# EasyEDA Pro project self-balancing-robot.eprj

# Schematic Schematic1
Board Name: Board1; Create Date: 2025-12-27; Page Name: P1; Project Name: self-balancing-robot; Schematic Name: Schematic1; Update Date: 2025-12-27; Company: EasyEDA.com; Page Size: A4; Version: V1.0
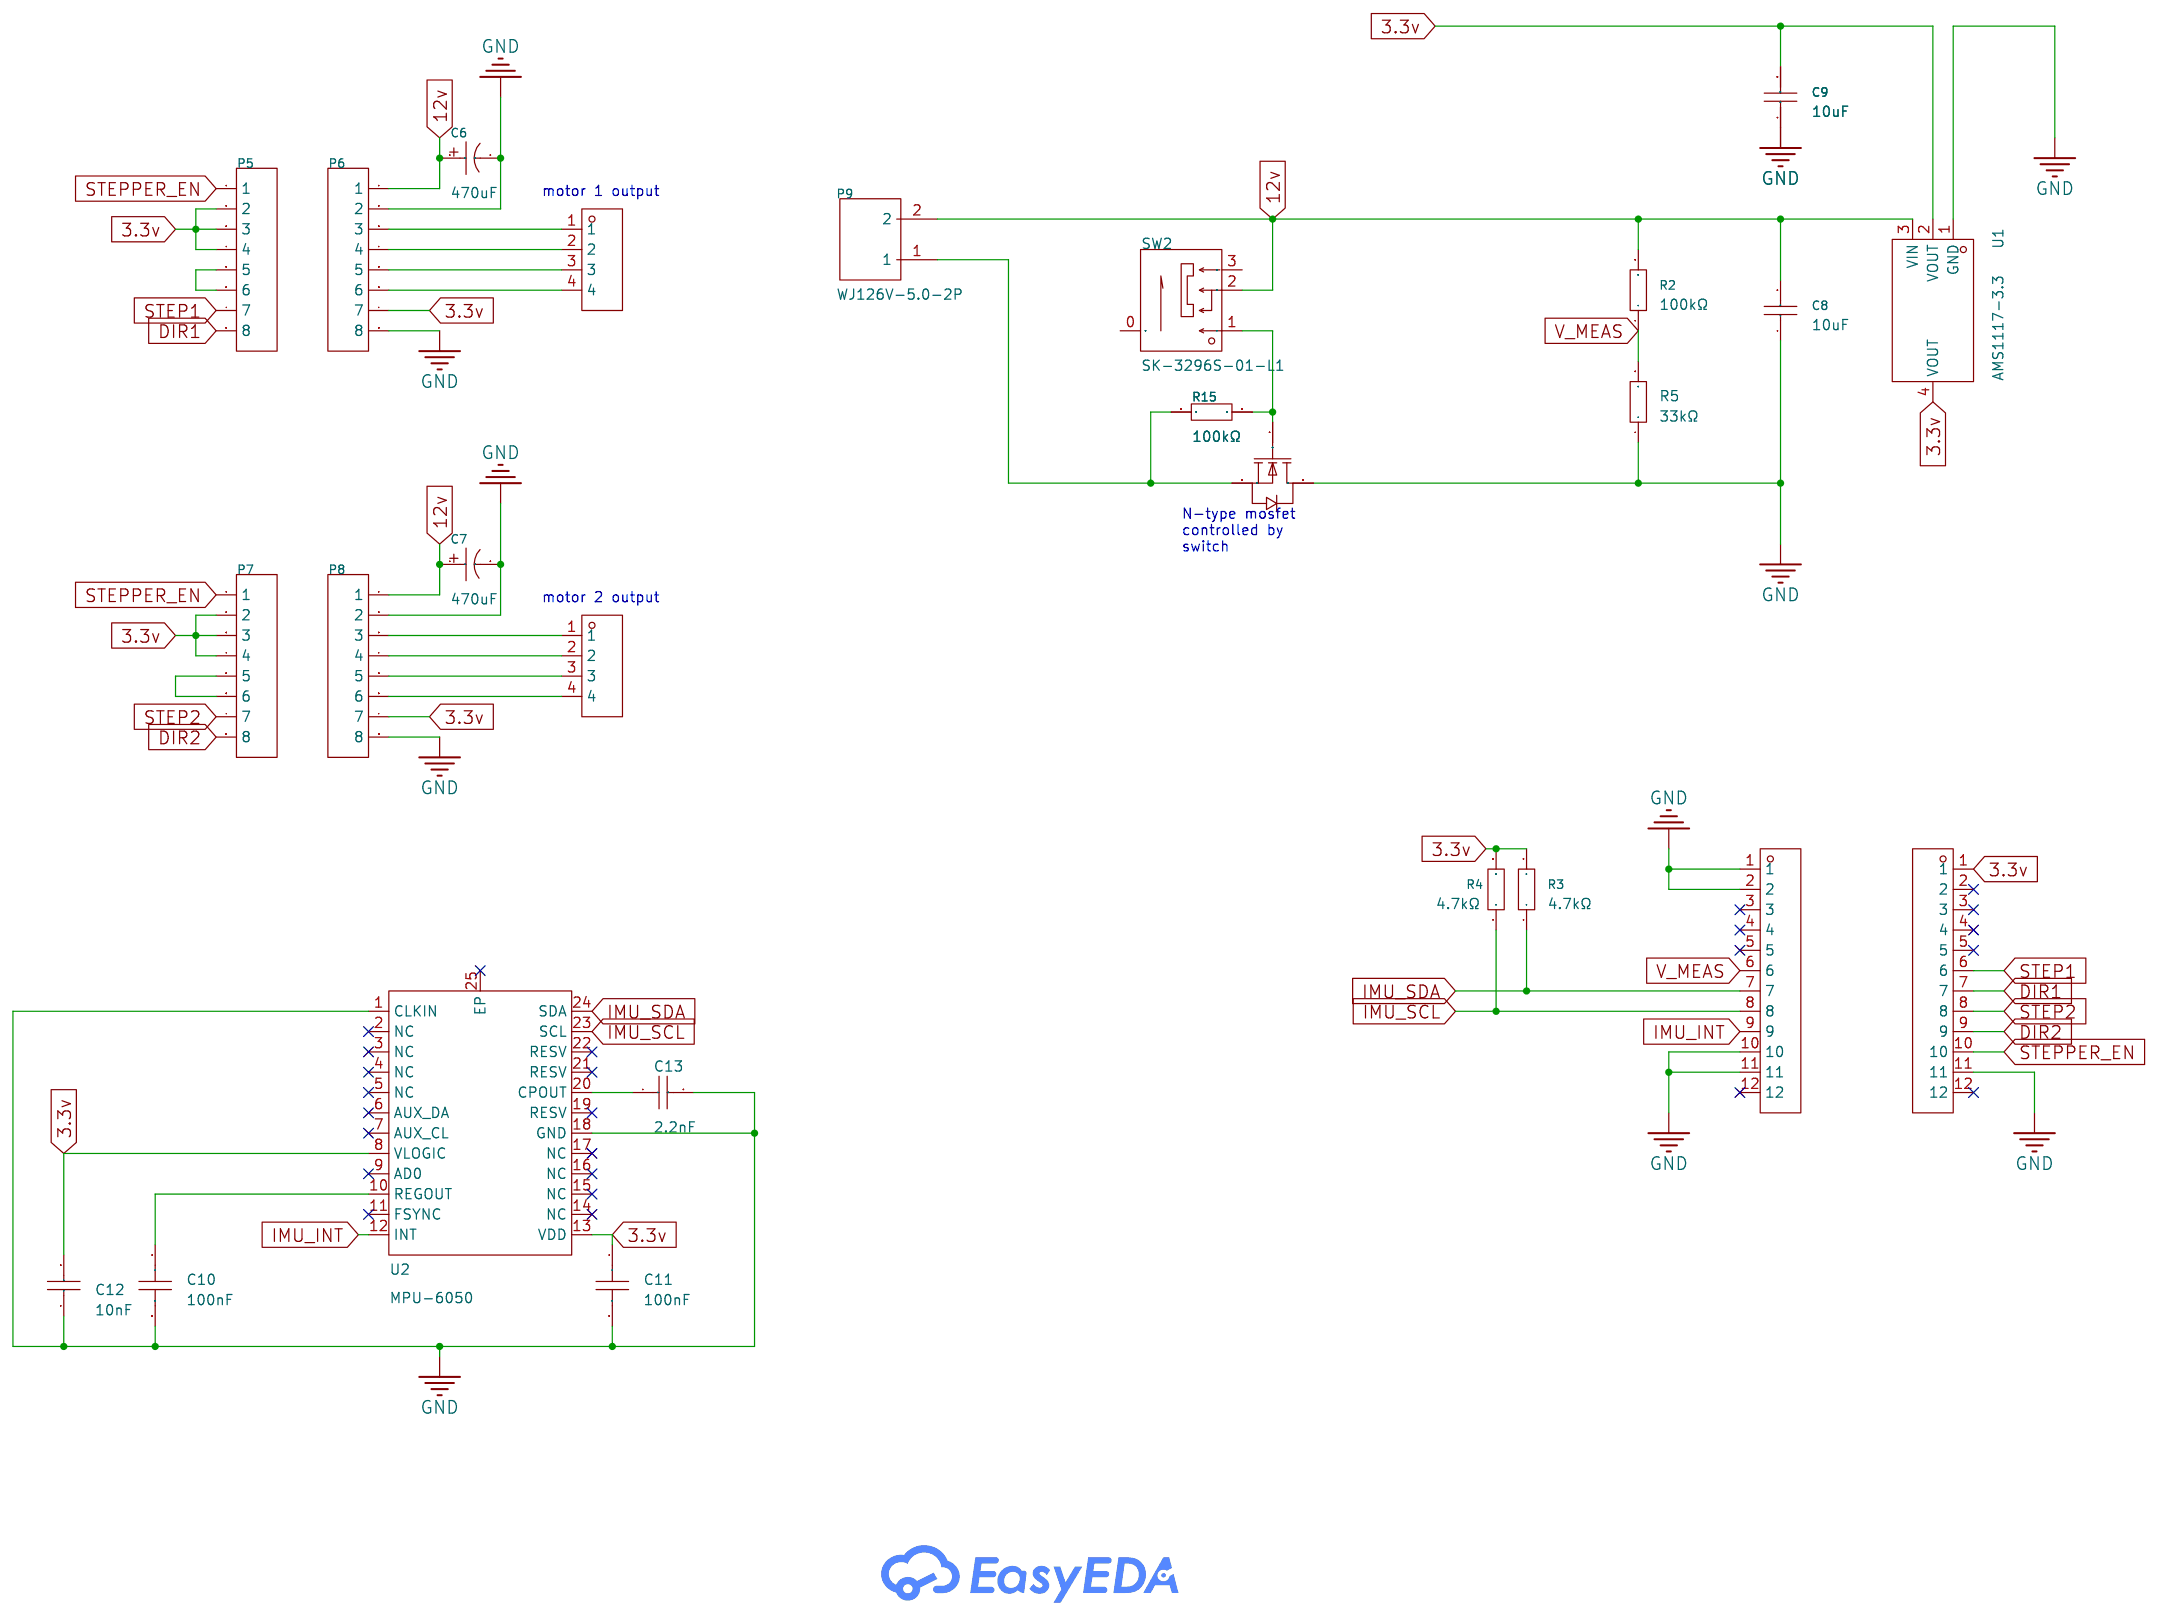
[diagram p0: schematic sheet]

## Parts
C6  470uF  [CAP-TH_BD8.0-P3.50-D0.6-FD]  (no BOM)
C7  470uF  [CAP-TH_BD8.0-P3.50-D0.6-FD]  (no BOM)
C8  10uF  [C1206]
C9  10uF  [C1206]
C10  100nF  [C0402]
C11  100nF  [C0402]
C12  10nF  [C0402]
C13  2.2nF  [C0402]
H1  PM2.54-1*12  [HDR-TH_12P-P2.54-V-F]  (no BOM)
H2  PM2.54-1*12  [HDR-TH_12P-P2.54-V-F]  (no BOM)
H5  2.54-1*4P母  [HDR-TH_4P-P2.54-V-F]  (no BOM)
H6  2.54-1*4P母  [HDR-TH_4P-P2.54-V-F]  (no BOM)
P5  2.54-1*8P母环保  [HDR-TH_8P-P2.54-V-F-1]  (no BOM)
P6  2.54-1*8P母环保  [HDR-TH_8P-P2.54-V-F-1]  (no BOM)
P7  2.54-1*8P母环保  [HDR-TH_8P-P2.54-V-F-1]  (no BOM)
P8  2.54-1*8P母环保  [HDR-TH_8P-P2.54-V-F-1]  (no BOM)
P9  WJ126V-5.0-2P  [CONN-TH_WJ126V-5.0-2P]  (no BOM)
Q1  AO3400A  [SOT-23-3_L2.9-W1.6-P1.90-LS2.8-BR]
R2  100kΩ  [R0402]
R3  4.7kΩ  [R0402]
R4  4.7kΩ  [R0402]
R5  33kΩ  [R0402]
R15  100kΩ  [R0402]
SW2  SK-3296S-01-L1  [SW-SMD_3P-P1.50_L2.7-W6.6]
U1  AMS1117-3.3  [SOT-223-3_L6.5-W3.4-P2.30-LS7.0-BR]
U2  MPU-6050  [QFN-24_L4.0-W4.0-P0.50-BL-EP2.7]

## Library data of the parts
C6 C7 = KM477M016F12RR0VH2FP0: Capacitance:470uF Tolerance:±20% Tolerance:±20% Rated Voltage: Lead Spacing: φD: L: Lifetime @ Temp:2000hrs@105℃; LCSC Part Name: 470uF ±20% 16V; Supplier Part: C28067; Manufacturer: CX(承兴); Supplier Footprint: 插件,D8xL12mm; JLCPCB Part Class: Extended Part; Datasheet: https://atta.szlcsc.com/upload/public/pdf/source/20211027/06D6BA3719C264B639DC286D935D03EA.pdf; Supplier: LCSC; Tolerance: ±20%; Lifetime @ Temp: 2000hrs@105℃
C8 C9 = CL31A106KBHNNNE: Capacitance: Tolerance:±10% Tolerance:±10% Voltage Rated: Temperature Coefficient:; LCSC Part Name: 10uF ±10% 50V; Supplier Part: C13585; Manufacturer: SAMSUNG(三星); Supplier Footprint: 1206; JLCPCB Part Class: Basic Part; Datasheet: https://atta.szlcsc.com/upload/public/pdf/source/20160218/1457707763339.pdf; Supplier: LCSC; Tolerance: ±10%
C10 C11 = CL05B104KO5NNNC: LCSC Part Name: 100nF ±10% 16V; Supplier Part: C1525; Manufacturer: SAMSUNG(三星); Supplier Footprint: 0402; JLCPCB Part Class: Basic Part; Datasheet: https://item.szlcsc.com/datasheet/CL05B104KO5NNNC/1877.html; Supplier: LCSC; Tolerance: ±10%; Voltage Rating: 16V; Temperature Coefficient: X7R
C12 = CL05B103KB5NNNC: LCSC Part Name: 10nF ±10% 50V; Supplier Part: C15195; Manufacturer: SAMSUNG(三星); Supplier Footprint: 0402; JLCPCB Part Class: Basic Part; Datasheet: https://item.szlcsc.com/datasheet/CL05B103KB5NNNC/15869.html; Supplier: LCSC; Tolerance: ±10%; Voltage Rating: 50V; Temperature Coefficient: X7R
C13 = 0402B222K500NT: LCSC Part Name: 2.2nF ±10% 50V; Supplier Part: C1531; Manufacturer: FH(风华); Supplier Footprint: 0402; JLCPCB Part Class: Extended Part; Datasheet: https://item.szlcsc.com/datasheet/0402B222K500NT/1883.html; Supplier: LCSC; Tolerance: ±10%; Voltage Rating: 50V; Temperature Coefficient: X7R
H1 H2 = PM2.54-1*12: Holes Structure:1x12P Pitch:2.54mm Row Spacing:2.54mm Circular Hole / Square Hole:方孔 Mounting Type:Straight Number of Rows:Plugin Number of Holes:12P Current Rating (Max):2.5A Holes Direction:Top Insulation Height:8.5mm Operating Temperature Range:-40℃~+1; LCSC Part Name: 间距:2.54mm 1x12P 直插; Supplier Part: C5224029; Manufacturer: ZHOURI(洲日); Supplier Footprint: 插件,P=2.54mm; JLCPCB Part Class: Extended Part; Datasheet: https://atta.szlcsc.com/upload/public/pdf/source/20221031/8E1EDE7098C69E0E34EB4CABE01AB99F.pdf; Supplier: LCSC; Holes Structure: 1x12P; Pitch: 2.54mm; Row Spacing: 2.54mm; Circular Hole / Square Hole: 方孔; Mounting Type: Straight; Number of Rows: Plugin; Number of Holes: 12P; Current Rating (Max): 2.5A; Holes Direction: Top; Insulation Height: 8.5mm; Operating Temperature Range: -40℃~+105℃
H5 H6 = 2.54-1*4P母: Holes Structure:1x4P Pitch:2.54mm Row Spacing:- Circular Hole / Square Hole:Square Holes Mounting Type:Straight Number of Rows:Plugin Number of Holes:4P Current Rating (Max):3A Voltage Rating (Max):- Holes Direction:Top Insulation Height:- Contact Materia; LCSC Part Name: 间距:2.54mm 1x4P 直插; Supplier Part: C2718488; Manufacturer: BOOMELE(博穆精密); Supplier Footprint: 插件,P=2.54mm; JLCPCB Part Class: Extended Part; Datasheet: https://atta.szlcsc.com/upload/public/pdf/source/20210301/C2718488_F4427B881E42CAA8DDB0B1C12B3A522C.pdf; Supplier: LCSC; Holes Structure: 1x4P; Pitch: 2.54mm; Circular Hole / Square Hole: Square Holes; Mounting Type: Straight; Number of Rows: Plugin; Number of Holes: 4P; Current Rating (Max): 3A; Holes Direction: Top; Contact Material: bronze; Operating Temperature Range: -40℃~+105℃
P5-P8 = 2.54-1*8P母环保: Holes Structure:1x8P Pitch:2.54mm Row Spacing:- Mounting Type:Straight Number of Rows:Plugin Number of Holes:8P Insulation Height:- Contact Material:- Contact Plating:-; LCSC Part Name: 间距:2.54mm 1x8P 直插; Supplier Part: C27438; Manufacturer: BOOMELE(博穆精密); Supplier Footprint: 插件,P=2.54mm; JLCPCB Part Class: Extended Part; Datasheet: https://atta.szlcsc.com/upload/public/pdf/source/20231221/1CA800C6799ED97958773716FAA1BFFE.pdf; Supplier: LCSC; Holes Structure: 1x8P; Pitch: 2.54mm; Mounting Type: Straight; Number of Rows: Plugin; Number of Holes: 8P
P9 = WJ126V-5.0-2P: Structure:1x2P Pitch:5mm Color:Green Mounting Style:Straight Current Rating (Max):18A Voltage Rating (Max):250V Number of Pins:2P Number of Rows:1 Wire Gauge - AWG:14~26 Wire Gauge - AWG:14~26 Wire Gauge - mm2:2.5 Wire Gauge - mm2:2.5 Number of PINs Per R; LCSC Part Name: 5mm 1x2P 排数:1 每排P数:2 直插; Supplier Part: C8404; Manufacturer: KANGNEX(康奈克斯电气); Supplier Footprint: 插件,P=5mm; JLCPCB Part Class: Extended Part; Datasheet: https://atta.szlcsc.com/upload/public/pdf/source/20191225/C8404_8F52D87DF851D149A4DEA9BD9FA83F9A.pdf; Supplier: LCSC; Structure: 1x2P; Pitch: 5mm; Color: Green; Mounting Style: Straight; Current Rating (Max): 18A; Voltage Rating (Max): 250V; Number of Pins: 2P; Number of Rows: 1; Wire Gauge - AWG: 14~26; Wire Gauge - mm2: 2.5; Number of PINs Per Row: 2; Operating Temperature Range: -40℃~+105℃
Q1 = AO3400A_C20917: Type:1个NChannel Drain Source Voltage (Vdss): Continuous Drain Current (Id): Power Dissipation (Pd): Drain Source On Resistance (RDS(on)@Vgs,Id):26.5mΩ@10V,5.7A Gate Threshold Voltage (Vgs(th)@Id):1.5V@250uA Total Gate Charge (Qg@Vgs):7nC@4.5V Input Capaci; LCSC Part Name: 1个N沟道 耐压:30V 电流:5.7A; Supplier Part: C20917; Manufacturer: AOS; Supplier Footprint: SOT-23-3L; JLCPCB Part Class: Basic Part; Datasheet: https://atta.szlcsc.com/upload/public/pdf/source/20140107/1457706668533.pdf; Supplier: LCSC; Type: 1个NChannel; Drain Source On Resistance (RDS(on)@Vgs,Id): 26.5mΩ@10V,5.7A; Gate Threshold Voltage (Vgs(th)@Id): 1.5V@250uA; Total Gate Charge (Qg@Vgs): 7nC@4.5V; Input Capacitance (Ciss@Vds): 630pF@15V; Operating Temperature: -55℃~+150℃@(Tj)
R2 = 0402WGF1003TCE: LCSC Part Name: 100kΩ ±1% 62.5mW 厚膜电阻; Supplier Part: C25741; Manufacturer: UNI-ROYAL(厚声); Supplier Footprint: 0402; JLCPCB Part Class: Basic Part; Datasheet: https://item.szlcsc.com/datasheet/0402WGF1003TCE/26484.html; Supplier: LCSC; Type: Thick Film Resistor; Tolerance: ±1%; Power(Watts): 62.5mW; Voltage-Supply(Max): 50V; Temperature Coefficient: ±100ppm/℃; Operating Temperature: -55℃~+155℃
R3 R4 = 0402WGF4701TCE: LCSC Part Name: 4.7kΩ ±1% 62.5mW 厚膜电阻; Supplier Part: C25900; Manufacturer: UNI-ROYAL(厚声); Supplier Footprint: 0402; JLCPCB Part Class: Basic Part; Datasheet: https://item.szlcsc.com/datasheet/0402WGF4701TCE/26643.html; Supplier: LCSC; Type: Thick Film Resistor; Tolerance: ±1%; Power(Watts): 62.5mW; Voltage-Supply(Max): 50V; Temperature Coefficient: ±100ppm/℃; Operating Temperature: -55℃~+155℃
R5 = 0402WGF3302TCE: LCSC Part Name: 33kΩ ±1% 62.5mW 厚膜电阻; Supplier Part: C25779; Manufacturer: UNI-ROYAL(厚声); Supplier Footprint: 0402; JLCPCB Part Class: Basic Part; Datasheet: https://atta.szlcsc.com/upload/public/pdf/source/20200306/C422600_1E6D84923E4A46A82E41ADD87F860B5C.pdf; Supplier: LCSC; Type: Thick Film Resistors; Tolerance: ±1%; Temperature Coefficient: ±100ppm/℃; Operating Temperature Range: -55℃~+155℃
R15 = 0402WGF1003TCE: LCSC Part Name: 100kΩ ±1% 62.5mW 厚膜电阻; Supplier Part: C25741; Manufacturer: UNI-ROYAL(厚声); Supplier Footprint: 0402; JLCPCB Part Class: Basic Part; Datasheet: https://item.szlcsc.com/datasheet/0402WGF1003TCE/26484.html; Supplier: LCSC; Type: Thick Film Resistor; Tolerance: ±1%; Power(Watts): 62.5mW; Voltage-Supply(Max): 50V; Temperature Coefficient: ±100ppm/℃; Operating Temperature: -55℃~+155℃; Operating Temperature Range: -55℃~+155℃
SW2 = SK-3296S-01-L1: Circuit:SPDT Actuator Style:Rectangular columnar Pin Style:SMDSplicing Switch Length:7.8mm Switch Width:2.75mm Switch Height:1.35mm Mounting Style:卧贴 Actuator Color:Black Current Rating (DC):50mA Voltage Rating (DC):12V Current Rating (AC):50mA Voltage Ra; LCSC Part Name: 柄长1.5mm 卧贴双档 滑动开关; Supplier Part: C319020; Manufacturer: XKB Connectivity(中国星坤); Supplier Footprint: SMD; JLCPCB Part Class: Extended Part; Datasheet: https://atta.szlcsc.com/upload/public/pdf/source/20211011/33977E7F5E3AE40A3E3DC6795807E20F.pdf; Supplier: LCSC; Circuit: SPDT; Actuator Style: Rectangular columnar; Pin Style: SMDSplicing; Switch Length: 7.8mm; Switch Width: 2.75mm; Switch Height: 1.35mm; Mounting Style: 卧贴; Actuator Color: Black; Current Rating (DC): 50mA; Voltage Rating (DC): 12V; Current Rating (AC): 50mA; Voltage Rating (AC): 12V; Mechanical Life: 1万次; Operating Temperature: -40℃~+85℃
U1 = AMS1117-3.3_C6186: Output Type: Maximum Input Voltage:- Output Voltage:3.3V Output Voltage:3.3V MAX Output Current:1A Power Supply Rejection Ratio (PSRR):72dB@(120Hz) Dropout Voltage:1.3V@(800mA) standby current:- Noise:- Feature:- Operating Temperature:- Operating Temperat; LCSC Part Name: 输出3.3V 1A; Supplier Part: C6186; Manufacturer: AMS; Supplier Footprint: SOT-223; JLCPCB Part Class: Basic Part; Datasheet: https://atta.szlcsc.com/upload/public/pdf/source/20180727/C6186_7A095716F0823C02F1997A905E26C086.pdf; Supplier: LCSC; Output Voltage: 3.3V; MAX Output Current: 1A; Power Supply Rejection Ratio (PSRR): 72dB@(120Hz); Dropout Voltage: 1.3V@(800mA); Output Polarity: Positive electrode; Number of Outputs: 1
U2 = MPU-6050: Supplier Part: C24112; Manufacturer: TDK InvenSense(应美盛); Supplier Footprint: QFN-24-EP(4x4); JLCPCB Part Class: Extended Part; Datasheet: https://item.szlcsc.com/datasheet/MPU-6050/24852.html; Supplier: LCSC; Sensor Type: Accelerometer Gyroscope; Operating Temperature: -40℃~+85℃

## Nets
3.3v: C9.2 C11.1 C12.2 H2.1 P5.2 P5.3 P5.4 P6.7 P7.2 P7.3 P7.4 P8.7 R3.2 R4.2 U1.2(VOUT) U1.4(VOUT) U2.8(VLOGIC) U2.13(VDD)
12v: C6.1 C7.1 C8.2 P6.1 P8.1 P9.2 R2.2 SW2.2 U1.3(VIN)
GND: C6.2 C7.2 C8.1 C9.1 C10.2 C11.2 C12.1 C13.2 H1.1 H1.2 H1.10 H1.11 H2.11 P6.2 P6.8 P8.2 P8.8 Q1.3(D) R5.1 U1.1(GND) U2.1(CLKIN) U2.18(GND)
DIR1: H2.7 P5.8
DIR2: H2.9 P7.8
IMU_INT: H1.9 U2.12(INT)
IMU_SCL: H1.8 R4.1 U2.23(SCL)
IMU_SDA: H1.7 R3.1 U2.24(SDA)
STEP1: H2.6 P5.7
STEP2: H2.8 P7.7
STEPPER_EN: H2.10 P5.1 P7.1
V_MEAS: H1.6 R2.1 R5.2
$1N623: P5.5 P5.6
$1N627: H5.1 P6.3
$1N628: H5.2 P6.4
$1N629: H5.3 P6.5
$1N630: H5.4 P6.6
$1N913: P7.5 P7.6
$1N917: H6.1 P8.3
$1N918: H6.2 P8.4
$1N919: H6.3 P8.5
$1N920: H6.4 P8.6
$1N2427: C10.1 U2.10(REGOUT)
$1N2780: C13.1 U2.20(CPOUT)
$1N3371: P9.1 Q1.2(S) R15.2
$1N4399: Q1.1(G) R15.1 SW2.1

Not connected (* = marked no-connect by the designer): H1 3* 4* 5* 12*; H2 2* 3* 4* 5* 12*; SW2 0 3; U2 2(NC)* 3(NC)* 4(NC)* 5(NC)* 6(AUX_DA)* 7(AUX_CL)* 9(AD0)* 11(FSYNC)* 14(NC)* 15(NC)* 16(NC)* 17(NC)* 19(RESV)* 21(RESV)* 22(RESV)* 25(EP)*

## Notes on the sheet
- motor 1 output
- N-type mosfet
  controlled by
  switch
- motor 2 output

# Board PCB1
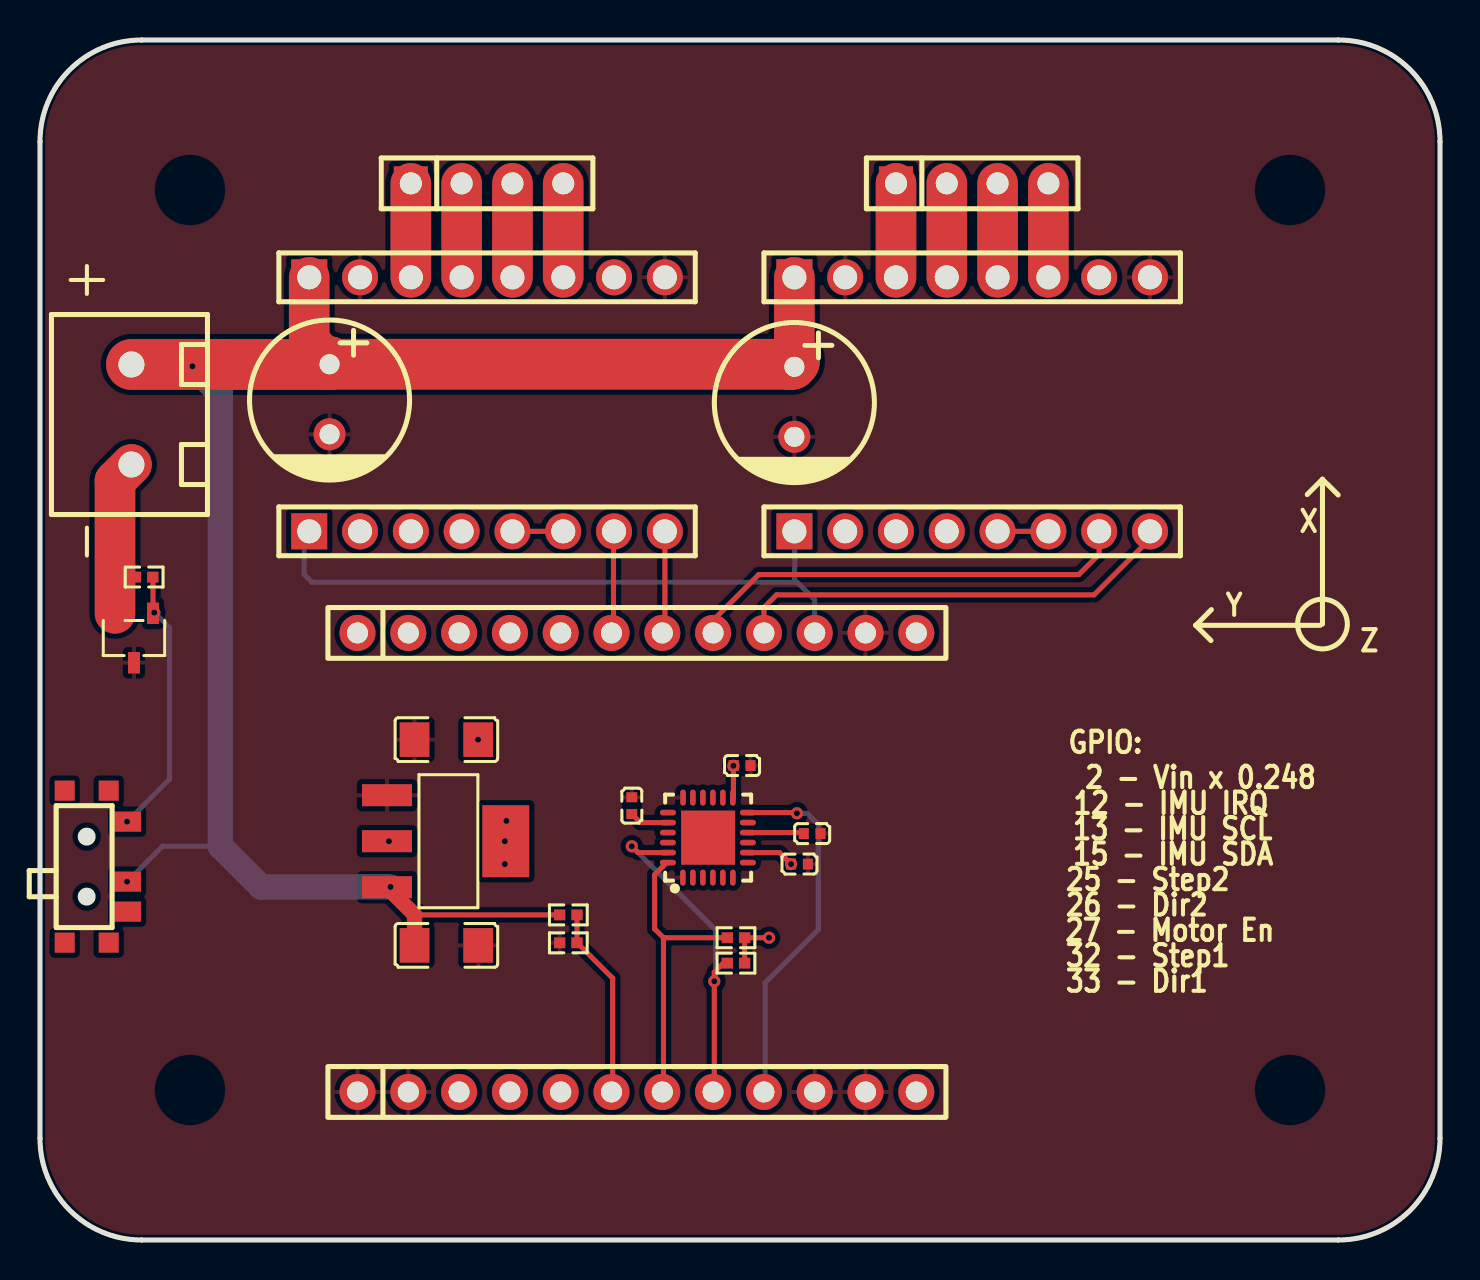
[diagram p1: board, top side]
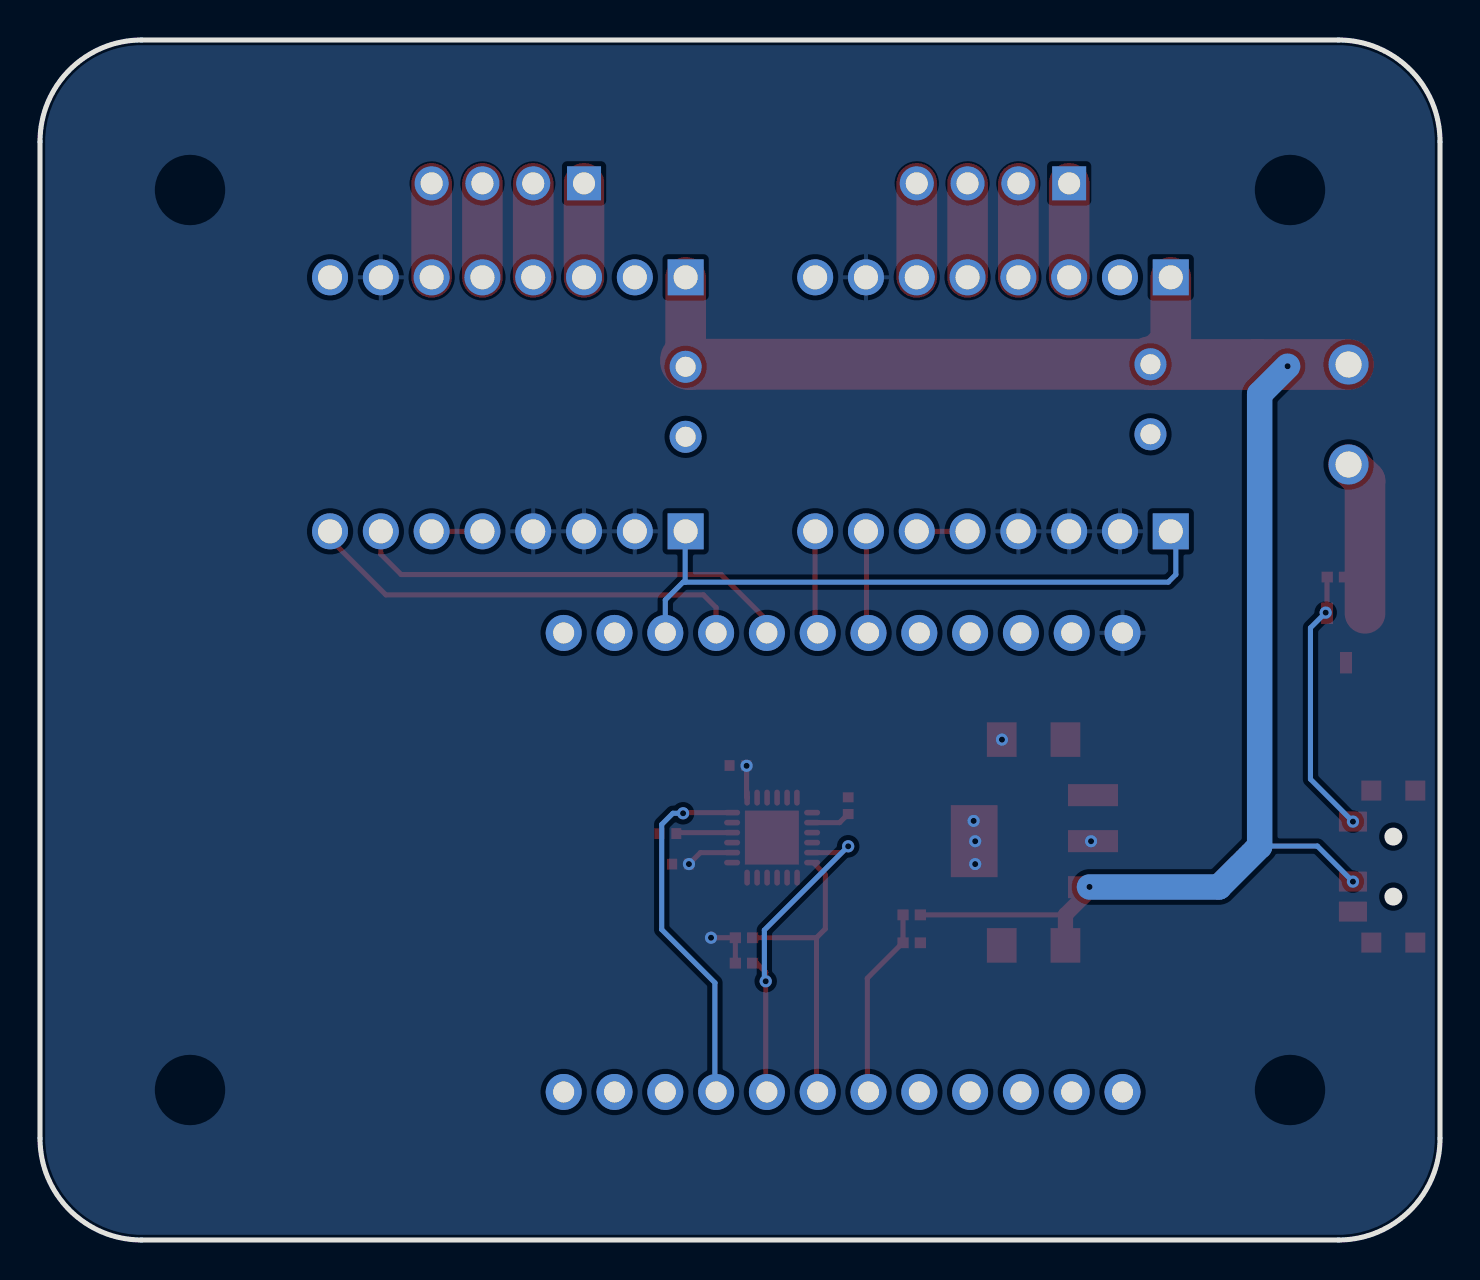
[diagram p2: board, bottom side, seen from below]

Outline 70 x 60 mm; copper layers: Top Layer, Bottom Layer. Coordinates in mm from the lower left corner of the outline.
Outline path: 0,54.92 0,5.08 arc(1.49,1.49) 5.08,0 64.92,0 arc(68.51,1.49) 70,5.08 70,54.92 arc(68.51,58.51) 64.92,60 5.08,60 arc(1.49,58.51) 0,54.92
Stack: Top Layer 0.035mm / Dielectric1 1.51mm FR4 er 4.5 / Bottom Layer 0.035mm

## Design rules (mm)
template: JLCPCB Capability(Two Layers Board)
spacing copperThickness1oz (default): track to track 0.102, other pairs 0.152 to 0.3
spacing copperThickness2oz: track to track 0.203, other pairs 0.152 to 0.3
track width copperThickness1oz (default): min 0.127, default 0.254, max 2.54
track width copperThickness2oz: min 0.203, default 0.254, max 2.54
differential pair differentialPair (default): width min 0.127, default 0.254, max 2.54; gap min 0.152, default 0.152
via viaSize (default): diameter min 0.5, default 0.61, max 10; hole min 0.3, default 0.305, max 6.3

## Placement (name value [footprint] x y rotation side)
C6  470uF  [CAP-TH_BD8.0-P3.50-D0.6-FD]  37.72 41.91 270 top
C7  470uF  [CAP-TH_BD8.0-P3.50-D0.6-FD]  14.48 42.04 270 top
C8  10uF  [C1206]  20.32 14.73 180 top
C9  10uF  [C1206]  20.32 25.02 0 top
C10  100nF  [C0402]  38.61 20.32 0 top
C11  100nF  [C0402]  37.97 18.8 0 top
C12  10nF  [C0402]  35.1 23.72 180 top
C13  2.2nF  [C0402]  29.59 21.72 90 top
H1  PM2.54-1*12  [HDR-TH_12P-P2.54-V-F]  29.84 7.4 0 top
H2  PM2.54-1*12  [HDR-TH_12P-P2.54-V-F]  29.84 30.35 0 top
H5  2.54-1*4P母  [HDR-TH_4P-P2.54-V-F]  46.61 52.83 0 top
H6  2.54-1*4P母  [HDR-TH_4P-P2.54-V-F]  22.35 52.83 0 top
P5  2.54-1*8P母环保  [HDR-TH_8P-P2.54-V-F-1]  22.35 35.43 0 top
P6  2.54-1*8P母环保  [HDR-TH_8P-P2.54-V-F-1]  46.61 48.13 0 top
P7  2.54-1*8P母环保  [HDR-TH_8P-P2.54-V-F-1]  46.61 35.43 0 top
P8  2.54-1*8P母环保  [HDR-TH_8P-P2.54-V-F-1]  22.35 48.13 0 top
P9  WJ126V-5.0-2P  [CONN-TH_WJ126V-5.0-2P]  4.57 41.28 180 top
Q1  AO3400A  [SOT-23-3_L2.9-W1.6-P1.90-LS2.8-BR]  4.7 30.1 90 top
R2  100kΩ  [R0402]  26.42 16.26 180 top
R3  4.7kΩ  [R0402]  34.8 15.11 0 top
R4  4.7kΩ  [R0402]  34.8 13.84 0 top
R5  33kΩ  [R0402]  26.42 14.86 0 top
R15  100kΩ  [R0402]  5.21 33.15 180 top
SW2  SK-3296S-01-L1  [SW-SMD_3P-P1.50_L2.7-W6.6]  2.79 18.67 270 top
U1  AMS1117-3.3  [SOT-223-3_L6.5-W3.4-P2.30-LS7.0-BR]  20.32 19.94 180 top
U2  MPU-6050  [QFN-24_L4.0-W4.0-P0.50-BL-EP2.7]  33.39 20.12 0 top

## Footprints (pads in the part's own frame, mm; a bottom-side part is the same pattern mirrored in y, then rotated)
C0402
  rect 0.5x0.54 smd: 1(-0.42,0) 2(0.42,0)
C1206
  rect 1.485x1.728 smd: 1(-1.593,0) 2(1.593,0)
CAP-TH_BD8.0-P3.50-D0.6-FD
  round 1.6 hole 1: 1(-1.75,0) 2(1.75,0)
CONN-TH_WJ126V-5.0-2P
  round 2 hole 1.3: 1(0,2.501) 2(0,-2.501)
HDR-TH_4P-P2.54-V-F
  rect 1.7x1.7 hole 1.1: 1(-3.81,0)
  round 1.7 hole 1.1: 2(-1.27,0) 3(1.27,0) 4(3.81,0)
HDR-TH_8P-P2.54-V-F-1
  rect 1.8x1.8 hole 1.2: 1(-8.89,0)
  round 1.8 hole 1.2: 2(-6.35,0) 3(-3.81,0) 4(-1.27,0) 5(1.27,0) 6(3.81,0) 7(6.35,0) 8(8.89,0)
HDR-TH_12P-P2.54-V-F
  round 1.8 hole 1.05: 1(-13.97,0) 2(-11.43,0) 3(-8.89,0) 4(-6.35,0) 5(-3.81,0) 6(-1.27,0) 7(1.27,0) 8(3.81,0) 9(6.35,0) 10(8.89,0) 11(11.43,0) 12(13.97,0)
QFN-24_L4.0-W4.0-P0.50-BL-EP2.7
  oval 0.28x0.8 smd: 1(-1.25,-2) 2(-0.75,-2) 3(-0.25,-2) 4(0.25,-2) 5(0.75,-2) 6(1.25,-2) 13(1.25,2) 14(0.75,2) 15(0.25,2) 16(-0.25,2) 17(-0.75,2) 18(-1.242,2)
  oval 0.8x0.28 smd: 7(2,-1.25) 8(2,-0.75) 9(2,-0.25) 10(2,0.25) 11(2,0.75) 12(2,1.25) 19(-2,1.25) 20(-2,0.75) 21(-2,0.25) 22(-2,-0.25) 23(-2,-0.75) 24(-2,-1.25)
  rect 2.7x2.7 smd: 25(0.013,0)
R0402
  rect 0.566x0.54 smd: 1(-0.433,0) 2(0.433,0)
SOT-23-3_L2.9-W1.6-P1.90-LS2.8-BR
  rect 1.07x0.6 smd: 1(1.235,-0.95) 2(1.235,0.95) 3(-1.235,0)
SOT-223-3_L6.5-W3.4-P2.30-LS7.0-BR
  rect 2.5x1.1 smd: 1(2.97,-2.3) 2(2.97,0) 3(2.97,2.3)
  rect 2.34x3.6 smd: 4(-2.97,0)
SW-SMD_3P-P1.50_L2.7-W6.6
  rect 1x1 smd: 0(-3.8,0.641) 0(-3.8,-1.559) 0(3.8,0.641) 0(3.8,-1.559)
  rect 1x1.4 smd: 1(-2.25,1.559) 2(0.75,1.559) 3(2.25,1.559)

## Nets
As in the schematic, except:
3.3V: C9.2 C11.1 C12.2 H2.1 P5.2 P5.3 P5.4 P6.7 P7.2 P7.3 P7.4 P8.7 R3.2 R4.2 U1.2 U1.4 U2.8 U2.13
12V: C6.1 C7.1 C8.2 P6.1 P8.1 P9.2 R2.2 SW2.2 U1.3

Pads without a net: H1 3 4 5 12; H2 2 3 4 5 12; SW2 0 3; U2 2 3 4 5 6 7 9 11 14 15 16 17 19 21 22 25

## Via types
v1: diameter 0.61, hole 0.305, Top Layer to Bottom Layer, 16 vias

## Routing (per net, layer and track width the routed paths; a pad name or vN(x,y) marks a point on that pad's centre or on a via; arc(x,y) is an arc through that point)
3.3V: length 6.5
  Top Layer w0.254: U2.8 36.98,19.37 v1(37.55,18.8) ; v1(34.67,23.71) 34.67,22.15 U2.13 ; R4.2 R3.2 36.45,15.11
  vias: v1(17.45,19.94) v1(21.9,25.02) v1(23.24,19.94) v1(23.24,18.8) v1(23.32,20.95) v1(36.45,15.11)
12V: length 92.4
  Top Layer w0.254: 9.14,43.78 9.14,44.2 ; R2.2 18.73,16.26
  Top Layer w0.762: C8.2 18.73,16.26 17.51,17.48
  Top Layer w2.032: P6.1 37.72,44.32 ; 14.48,43.91 13.46,44.93 P8.1
  Top Layer w2.54: 37.72,43.91 37.59,43.79 37.47,43.79 ; P9.2 14.34,43.78 14.48,43.91 14.61,43.79 37.47,43.79 ; 37.47,43.79 37.72,44.04
  Bottom Layer w0.254: 9.01,19.7 6.13,19.7 v1(4.35,17.92)
  Bottom Layer w1.27: v1(17.53,17.65) 11.05,17.65 9.02,19.69 9.02,42.29 v1(7.62,43.69)
DIR1: length 5.6
  Top Layer w0.254: 30.99,35.43 31.25,35.17 31.25,30.36 ; 31.25,30.36 30.99,30.1 ; 31.25,30.36 31.25,30.35
DIR2: length 22.5
  Top Layer w0.254: 55.75,35.43 55.5,35.18 55.5,35.05 52.71,32.26 36.83,32.26 36.19,31.62 H2.9
IMU_INT: length 18.1
  Top Layer w0.254: U2.12 37.81,21.37 v1(37.85,21.34)
  Bottom Layer w0.254: v1(37.85,21.34) 38.35,21.34 38.91,20.78 38.91,15.52 36.25,12.86 36.25,7.6 36.32,7.53
IMU_SCL: length 17.2
  Top Layer w0.254: v1(29.59,19.69) 29.91,19.37 U2.23 ; R4.1 34.16,13.84 33.71,13.39 v1(33.71,12.94) 33.71,7.6 33.78,7.53
  Bottom Layer w0.254: v1(33.71,12.94) 33.78,13 33.78,15.49 v1(29.59,19.69)
IMU_SDA: length 15
  Top Layer w0.254: 31.17,15.11 31.17,7.6 31.24,7.53 ; 31.17,15.11 30.73,15.55 30.73,18.27 31.34,18.87 U2.24 ; 31.17,15.11 R3.1
STEP1: length 5.5
  Top Layer w0.254: 28.45,30.1 28.67,30.33 28.67,35.21 28.45,35.43
STEP2: length 22.5
  Top Layer w0.254: 33.66,31.11 H2.8 ; 53.21,35.43 52.96,35.18 52.96,34.29 51.94,33.27 35.94,33.27 33.78,31.11
STEPPER_EN: length 33
  Bottom Layer w0.254: 38.86,29.73 38.86,30.35 ; P7.1 37.74,35.41 37.74,32.89 ; 37.74,32.89 37.85,32.89 38.74,32 H2.10 ; 37.74,32.89 13.59,32.89 13.21,33.27 13.21,35.43
V_MEAS: length 9.5
  Top Layer w0.254: 28.7,7.53 28.63,7.6 28.63,13.09 26.82,14.9 26.85,14.93 R2.1
$1N623: length 2.5
  Top Layer w0.254: 23.37,35.43 25.91,35.43
$1N627: length 4.7
  Top Layer w2.032: P6.3 H5.1
$1N628: length 4.7
  Top Layer w2.032: P6.4 H5.2
$1N629: length 4.7
  Top Layer w2.032: P6.5 H5.3
$1N630: length 4.7
  Top Layer w2.032: P6.6 H5.4
$1N913: length 2.5
  Top Layer w0.254: 48.13,35.43 50.67,35.43
$1N917: length 4.7
  Top Layer w2.032: P8.3 H6.1
$1N918: length 4.7
  Top Layer w2.032: P8.4 H6.2
$1N919: length 4.7
  Top Layer w2.032: P8.5 H6.3
$1N920: length 4.7
  Top Layer w2.032: P8.6 H6.4
$1N2427: length 2.8
  Top Layer w0.254: C10.1 38.14,20.37 U2.10
$1N2780: length 2
  Top Layer w0.254: C13.1 30.02,20.87 U2.20
$1N3371: length 7.8
  Top Layer w2.032: P9.1 3.75,37.95 Q1.2
$1N4399: length 13.5
  Top Layer w0.254: Q1.1 5.65,33.14 R15.1
  Bottom Layer w0.254: v1(4.35,20.92) 6.48,23.04 6.48,30.61 v1(5.72,31.37)

## Copper pours and planes (outline as drawn; the poured copper is in the pictures)
3.3V on Bottom Layer: 0.07,59.97 70.29,59.97 70.29,-0.03 0.07,-0.03
GND on Top Layer: 0.07,59.97 70.29,59.97 70.29,-0.03 0.07,-0.03

## Text on the board
Top Silkscreen Layer: 27 - Motor En | 25 - Step2 | 26 - Dir2 | 32 - Step1 | 33 - Dir1 | Y | X | Z | GPIO: | 13 - IMU SCL | 15 - IMU SDA | 12 - IMU IRQ | 2 - Vin x 0.248 | + | -
